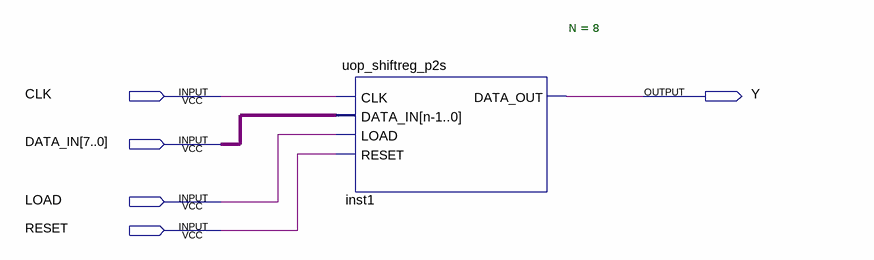
[diagram p0: schematic sheet]
// Quartus schematic behavioural.bdf as structural Verilog: 1 symbols, 5 pins
module behavioural (
  input  CLK,
  input  [7:0] DATA_IN,
  input  LOAD,
  input  RESET,
  output Y
);

  uop_shiftreg_p2s #(.N(8)) inst1 (.CLK(CLK), .DATA_IN(DATA_IN), .LOAD(LOAD), .RESET(RESET), .DATA_OUT(Y));
endmodule
